# EAGLE design electronic_load (EAGLE 7.3.0)

## Sheet 1 of 2
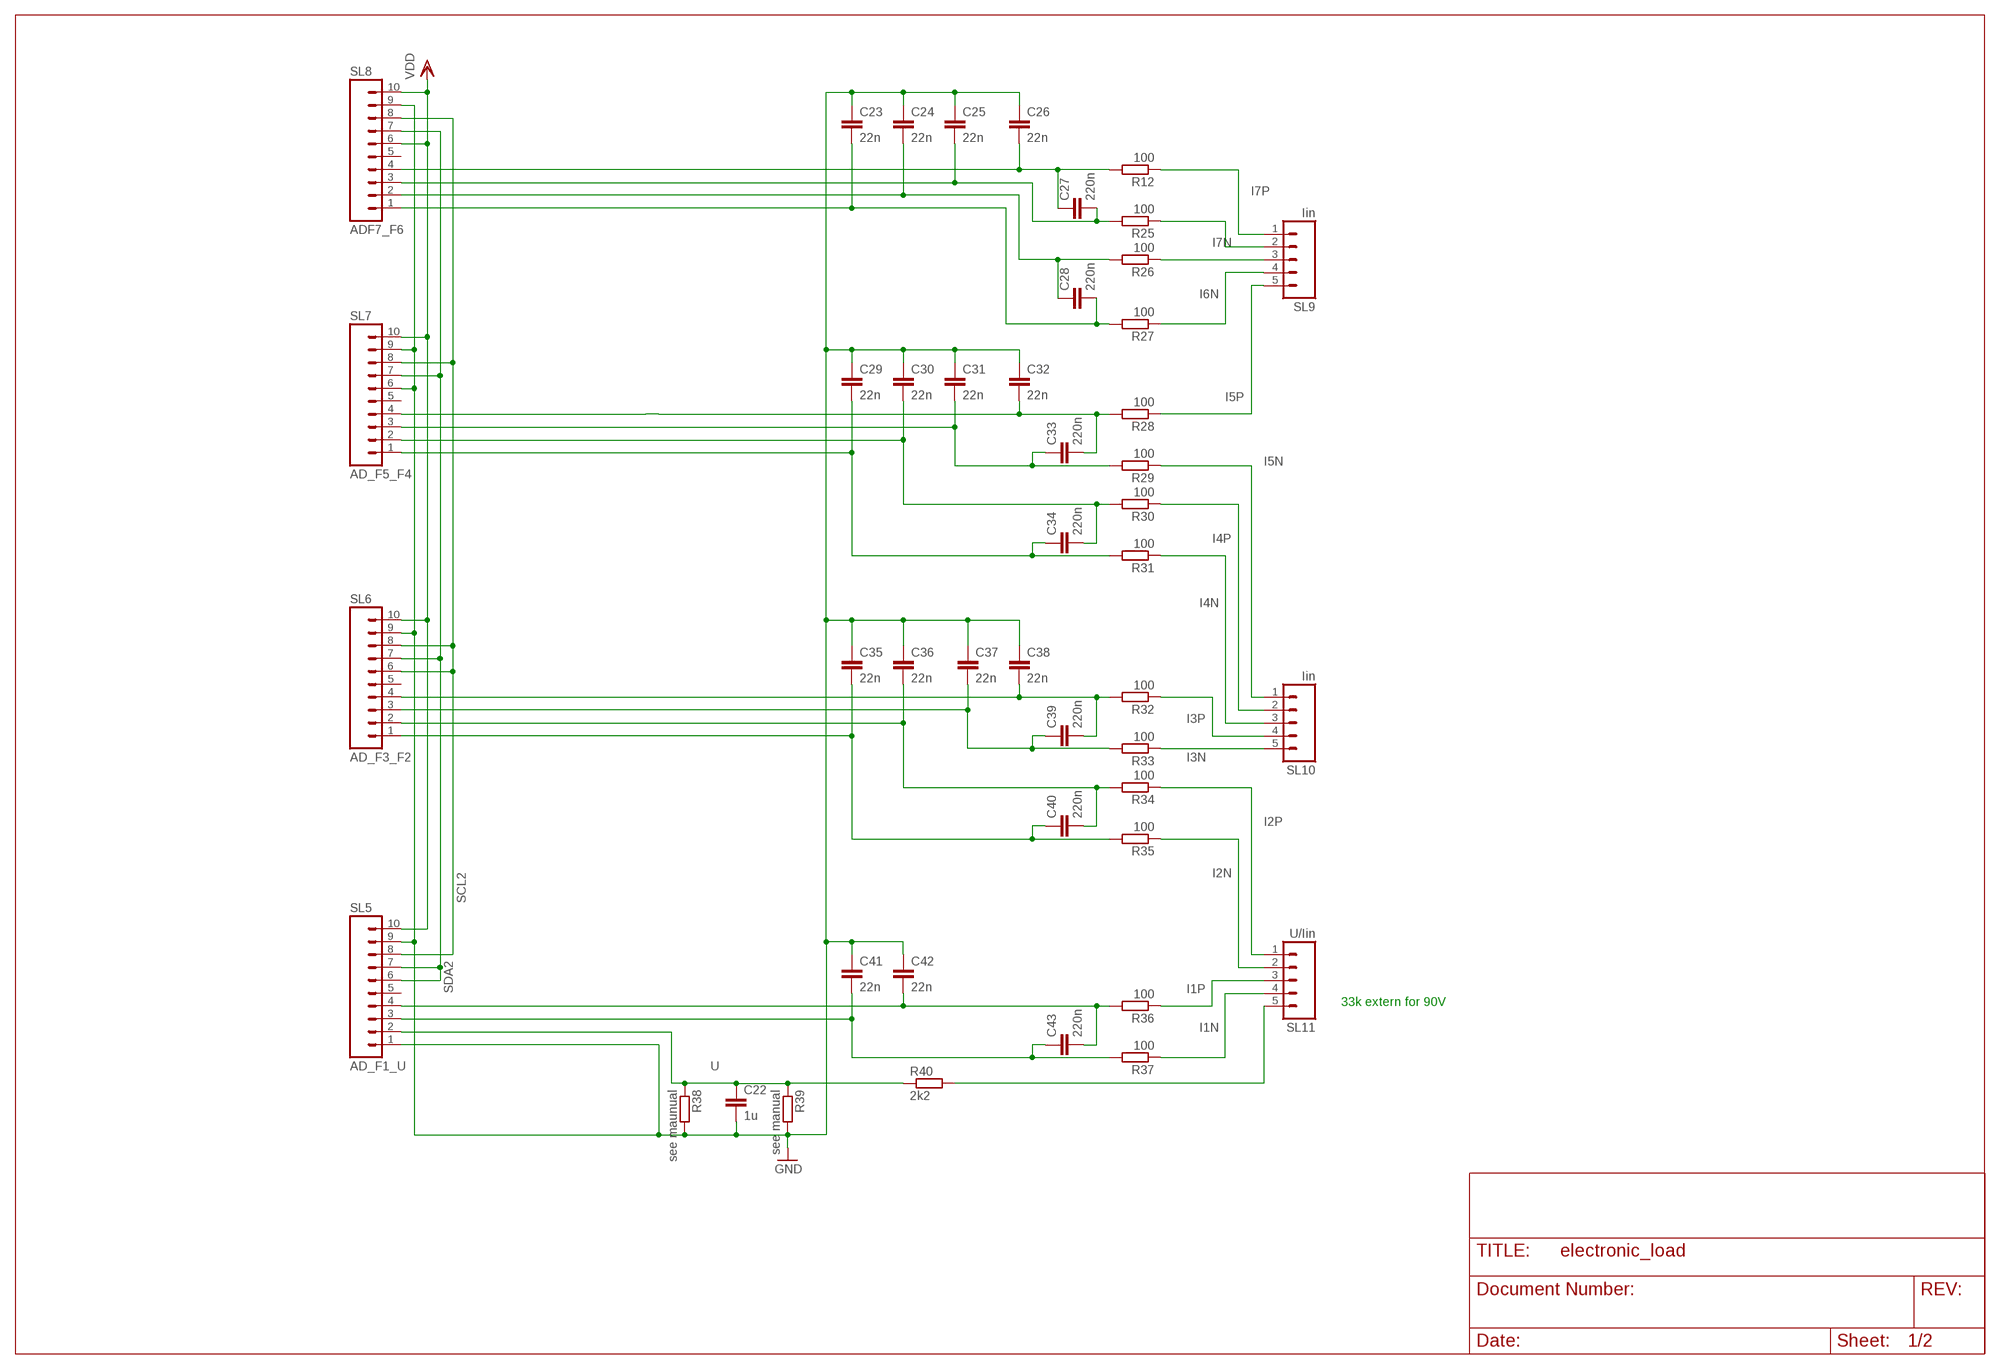
[diagram p0: schematic, sheet 1]

### Parts
C22  1u  C-EUC1206  [C1206]
C23  22n  C-EUC1206  [C1206]
C24  22n  C-EUC1206  [C1206]
C25  22n  C-EUC1206  [C1206]
C26  22n  C-EUC1206  [C1206]
C27  220n  C-EUC1206  [C1206]
C28  220n  C-EUC1206  [C1206]
C29  22n  C-EUC1206  [C1206]
C30  22n  C-EUC1206  [C1206]
C31  22n  C-EUC1206  [C1206]
C32  22n  C-EUC1206  [C1206]
C33  220n  C-EUC1206  [C1206]
C34  220n  C-EUC1206  [C1206]
C35  22n  C-EUC1206  [C1206]
C36  22n  C-EUC1206  [C1206]
C37  22n  C-EUC1206  [C1206]
C38  22n  C-EUC1206  [C1206]
C39  220n  C-EUC1206  [C1206]
C40  220n  C-EUC1206  [C1206]
C41  22n  C-EUC1206  [C1206]
C42  22n  C-EUC1206  [C1206]
C43  220n  C-EUC1206  [C1206]
R12  100  R-EU_R1206  [R1206]
R25  100  R-EU_R1206  [R1206]
R26  100  R-EU_R1206  [R1206]
R27  100  R-EU_R1206  [R1206]
R28  100  R-EU_R1206  [R1206]
R29  100  R-EU_R1206  [R1206]
R30  100  R-EU_R1206  [R1206]
R31  100  R-EU_R1206  [R1206]
R32  100  R-EU_R1206  [R1206]
R33  100  R-EU_R1206  [R1206]
R34  100  R-EU_R1206  [R1206]
R35  100  R-EU_R1206  [R1206]
R36  100  R-EU_R1206  [R1206]
R37  100  R-EU_R1206  [R1206]
R38  see maunual  R-EU_R1206  [R1206]
R39  see manual  R-EU_R1206  [R1206]
R40  2k2  R-EU_R1206  [R1206]
SL5  AD_F1_U  M10  [10P]
SL6  AD_F3_F2  M10  [10P]
SL7  AD_F5_F4  M10  [10P]
SL8  ADF7_F6  M10  [10P]
SL9  Iin  M05  [05P]
SL10  Iin  M05  [05P]
SL11  U/Iin  M05  [05P]

### Nets
GND: C22.2 C23.1 C24.1 C25.1 C26.1 C29.1 C30.1 C31.1 C32.1 C35.1 C36.1 C37.1 C38.1 C41.1 C42.1 R38.2 R39.2 SL5.1 SL5.9 SL6.9 SL7.6 SL7.9 SL8.9 ; also sheet 2
I1N: R37.1 SL11.4
I1P: R36.1 SL11.3
I2N: R35.1 SL11.2
I2P: R34.1 SL11.1
I3N: R33.1 SL10.5
I3P: R32.1 SL10.4
I4N: R31.1 SL10.3
I4P: R30.1 SL10.2
I5N: R29.1 SL10.1
I5P: R28.1 SL9.5
I6N: R27.1 SL9.4
I6P: R26.1 SL9.3
I7N: R25.1 SL9.2
I7P: R12.1 SL9.1
N$1: C26.2 C27.1 R12.2 SL8.4
N$8: C32.2 C33.2 R28.2 SL7.4
N$27: R40.2 SL11.5
N$29: C31.2 C33.1 R29.2 SL7.3
N$30: C30.2 C34.2 R30.2 SL7.2
N$32: C29.2 C34.1 R31.2 SL7.1
N$45: C38.2 C39.2 R32.2 SL6.4
N$48: C37.2 C39.1 R33.2 SL6.3
N$49: C36.2 C40.2 R34.2 SL6.2
N$70: C24.2 C28.1 R26.2 SL8.2
N$71: C25.2 C27.2 R25.2 SL8.3
N$72: C35.2 C40.1 R35.2 SL6.1
N$74: C23.2 C28.2 R27.2 SL8.1
N$76: C42.2 C43.2 R36.2 SL5.4
N$78: C41.2 C43.1 R37.2 SL5.3
SCL2: SL5.8 SL6.6 SL6.8 SL7.8 SL8.8 ; also sheet 2
SDA2: SL5.6 SL5.7 SL6.7 SL7.7 SL8.7 ; also sheet 2
U: C22.1 R38.1 R39.1 R40.1 SL5.2
VDD: SL5.10 SL6.10 SL7.10 SL8.6 SL8.10 ; also sheet 2
Unconnected: SL5.5 SL6.5 SL7.5 SL8.5

### Notes on the sheet
- 33k extern for 90V

## Sheet 2 of 2
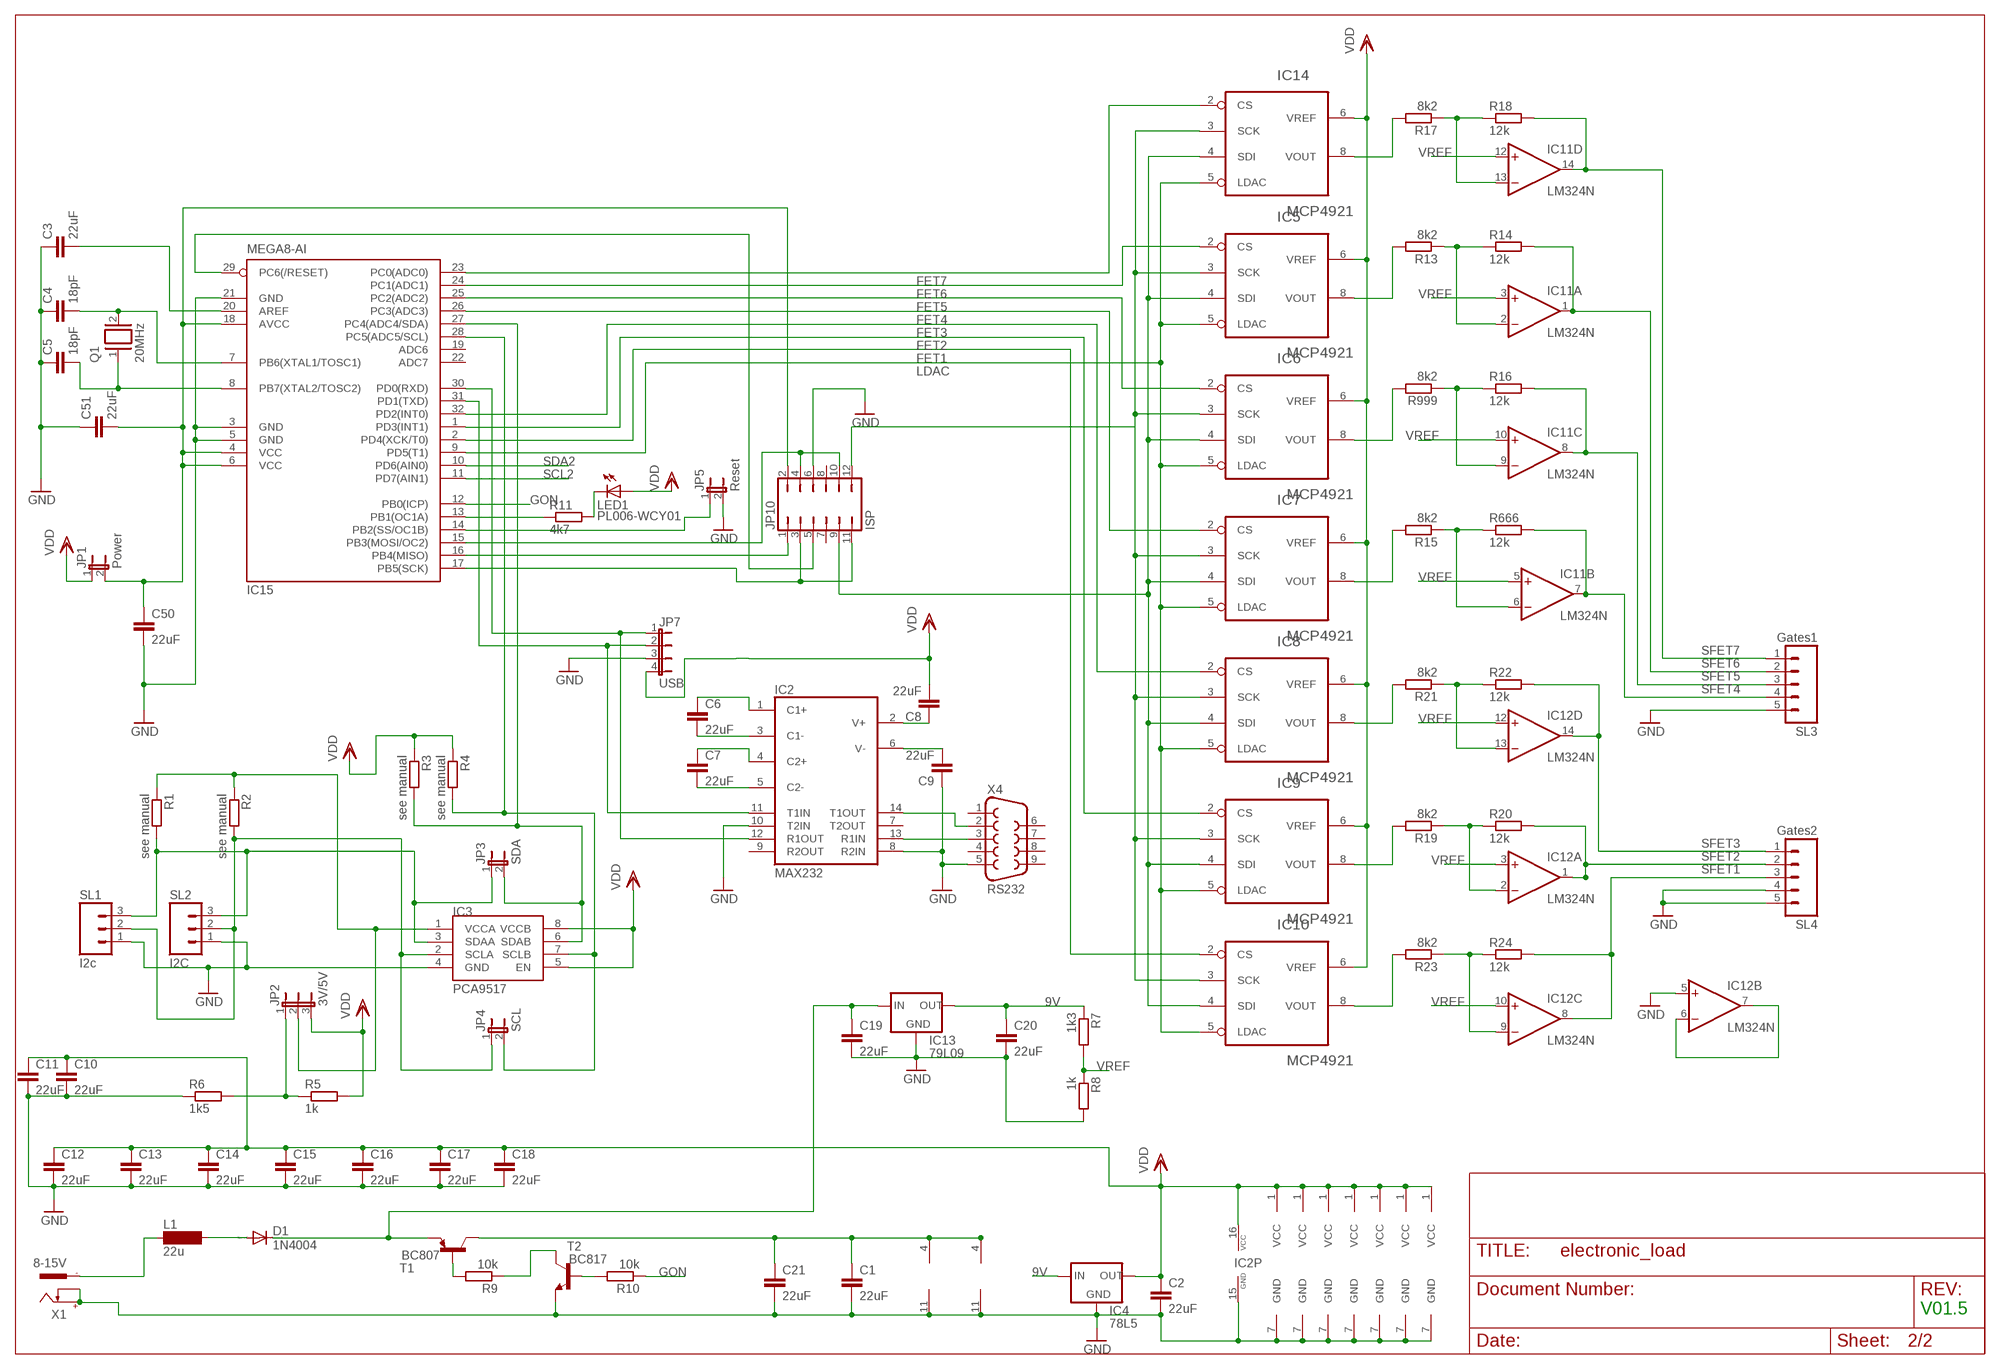
[diagram p1: schematic, sheet 2]

### Parts
C1  22uF  C-EUC1206  [C1206]
C2  22uF  C-EUC1206  [C1206]
C3  22uF  C-EUC1206  [C1206]
C4  18pF  C-EU025-025X050  [C025-025X050]
C5  18pF  C-EU025-025X050  [C025-025X050]
C6  22uF  C-EUC1206  [C1206]
C7  22uF  C-EUC1206  [C1206]
C8  22uF  C-EUC1206  [C1206]
C9  22uF  C-EUC1206  [C1206]
C10  22uF  C-EUC1206  [C1206]
C11  22uF  C-EUC1206  [C1206]
C12  22uF  C-EUC1206  [C1206]
C13  22uF  C-EUC1206  [C1206]
C14  22uF  C-EUC1206  [C1206]
C15  22uF  C-EUC1206  [C1206]
C16  22uF  C-EUC1206  [C1206]
C17  22uF  C-EUC1206  [C1206]
C18  22uF  C-EUC1206  [C1206]
C19  22uF  C-EUC1206  [C1206]
C20  22uF  C-EUC1206  [C1206]
C21  22uF  C-EUC1206  [C1206]
C50  22uF  C-EUC1206  [C1206]
C51  22uF  C-EUC1206  [C1206]
D1  1N4004  [DO41-10]
IC2  MAX232  [DIL16]
IC3  PCA9517  [SO-08]
IC4  78L5  78LXX  [78LXX]
IC5  MCP4921  MCP491  [DIL08]
IC6  MCP4921  MCP491  [DIL08]
IC7  MCP4921  MCP491  [DIL08]
IC8  MCP4921  MCP491  [DIL08]
IC9  MCP4921  MCP491  [DIL08]
IC10  MCP4921  MCP491  [DIL08]
IC11  LM324N  [DIL14]
IC12  LM324N  [DIL14]
IC13  79L09  78LXX  [78LXX]
IC14  MCP4921  MCP491  [DIL08]
IC15  MEGA8-AI  [TQFP32-08]
JP1  Power  JP1E  [JP1]
JP2  3V/5V  JP2E  [JP2]
JP3  SDA  JP1E  [JP1]
JP4  SCL  JP1E  [JP1]
JP5  Reset  JP1E  [JP1]
JP7  USB  JP4E  [JP4]
JP10  ISP  JP6Q  [JP6Q]
L1  22u  MS85  [MS85]
LED1  PL006-WCY01  [SOT23]
Q1  20MHz  XTAL/S  [QS]
R1  see manual  R-EU_R1206  [R1206]
R2  see manual  R-EU_R1206  [R1206]
R3  see manual  R-EU_R1206  [R1206]
R4  see manual  R-EU_R1206  [R1206]
R5  1k  R-EU_R1206  [R1206]
R6  1k5  R-EU_R1206  [R1206]
R7  1k3  R-EU_R1206  [R1206]
R8  1k  R-EU_R1206  [R1206]
R9  10k  R-EU_R1206  [R1206]
R10  10k  R-EU_R1206  [R1206]
R11  4k7  R-EU_R1206  [R1206]
R13  8k2  R-EU_R1206  [R1206]
R14  12k  R-EU_R1206  [R1206]
R15  8k2  R-EU_R1206  [R1206]
R16  12k  R-EU_R1206  [R1206]
R17  8k2  R-EU_R1206  [R1206]
R18  12k  R-EU_R1206  [R1206]
R19  8k2  R-EU_R1206  [R1206]
R20  12k  R-EU_R1206  [R1206]
R21  8k2  R-EU_R1206  [R1206]
R22  12k  R-EU_R1206  [R1206]
R23  8k2  R-EU_R1206  [R1206]
R24  12k  R-EU_R1206  [R1206]
R666  12k  R-EU_R1206  [R1206]
R999  8k2  R-EU_R1206  [R1206]
SL1  I2c  M03  [03P]
SL2  I2C  M03  [03P]
SL3  Gates1  M05  [05P]
SL4  Gates2  M05  [05P]
T1  BC807  BC807-16-PNP-SOT23-BEC  [SOT23-BEC]
T2  BC817  BC817-16-NPN-SOT23-BEC  [SOT23-BEC]
X1  8-15V  737992-55  [737992-5]
X4  RS232  F09H  [F09H]

### Nets
9V: C20.1 IC4.IN IC13.OUT R7.1
C13: C6.1 IC2.1(C1+)
FET1: IC10.2(CS) IC15.2(PD4(XCK/T0))
FET2: IC9.2(CS) IC15.1(PD3(INT1))
FET3: IC8.2(CS) IC15.32(PD2(INT0))
FET4: IC7.2(CS) IC15.26(PC3(ADC3))
FET5: IC6.2(CS) IC15.25(PC2(ADC2))
FET6: IC5.2(CS) IC15.24(PC1(ADC1))
FET7: IC14.2(CS) IC15.23(PC0(ADC0))
GND: C1.2 C2.2 C3.1 C4.1 C5.1 C9.1 C10.2 C11.2 C12.2 C13.2 C14.2 C15.2 C16.2 C17.2 C18.2 C19.2 C20.2 C21.2 C50.2 C51.1 IC2.8(R2IN) IC2.10(T2IN) IC2.15(GND) IC3.4(GND) IC4.GND IC5.7(GND) IC6.7(GND) IC7.7(GND) IC8.7(GND) IC9.7(GND) IC10.7(GND) IC11.11(P:V-) IC12.5(B:+IN) IC12.11(P:V-) IC13.GND IC14.7(GND) IC15.3(GND) IC15.5(GND) IC15.21(GND) JP5.2 JP7.3 JP10.6 R6.1 R8.2 SL1.1 SL2.1 SL3.5 SL4.4 SL4.5 T2.E X1.+ X1.K X4.5 ; also sheet 1
GON: IC15.12(PB0(ICP)) R10.1
LDAC: IC5.5(LDAC) IC6.5(LDAC) IC7.5(LDAC) IC8.5(LDAC) IC9.5(LDAC) IC10.5(LDAC) IC14.5(LDAC) IC15.9(PD5(T1))
N$3: C7.2 IC2.5(C2-)
N$4: C50.1 C51.2 IC15.4(VCC) IC15.6(VCC) IC15.18(AVCC) JP1.2 JP10.2
N$5: IC3.3(SDAA) JP3.1 R1.2 SL1.3 SL2.3
N$6: IC2.11(T1IN) IC15.31(PD1(TXD)) JP7.2
N$7: L1.1 X1.-1
N$9: IC2.13(R1IN) X4.3
N$10: IC6.8(VOUT) R999.2
N$11: C5.2 IC15.8(PB7(XTAL2/TOSC2)) Q1.1
N$12: D1.A L1.2
N$13: C7.1 IC2.4(C2+)
N$14: C6.2 IC2.3(C1-)
N$15: IC15.16(PB4(MISO)) JP10.1
N$16: C8.1 IC2.2(V+)
N$17: C9.2 IC2.6(V-)
N$18: IC15.29(PC6(/RESET)) JP10.5
N$19: C4.2 IC15.7(PB6(XTAL1/TOSC1)) Q1.2
N$20: IC5.4(SDI) IC6.4(SDI) IC7.4(SDI) IC8.4(SDI) IC9.4(SDI) IC10.4(SDI) IC14.4(SDI) JP10.9
N$21: IC14.8(VOUT) R17.2
N$22: IC3.2(SCLA) JP4.1 R2.2 SL1.2 SL2.2
N$23: IC15.15(PB3(MOSI/OC2)) JP10.4 JP10.10
N$24: IC9.8(VOUT) R19.2
N$26: IC8.8(VOUT) R21.2
N$28: IC5.3(SCK) IC6.3(SCK) IC7.3(SCK) IC8.3(SCK) IC9.3(SCK) IC10.3(SCK) IC14.3(SCK) JP10.12
N$31: IC5.8(VOUT) R13.2
N$33: IC2.14(T1OUT) X4.2
N$35: IC3.6(SDAB) IC15.27(PC4(ADC4/SDA)) JP3.2 R3.2
N$36: IC11.13(D:-IN) R17.1 R18.1
N$37: IC15.14(PB2(SS/OC1B)) JP5.1
N$38: IC11.9(C:-IN) R16.1 R999.1
N$39: IC10.8(VOUT) R23.2
N$40: IC12.13(D:-IN) R21.1 R22.1
N$42: IC2.12(R1OUT) IC15.30(PD0(RXD)) JP7.1
N$43: LED1.3(C) R11.2
N$46: IC15.17(PB5(SCK)) JP10.3 JP10.11
N$50: IC3.7(SCLB) IC15.28(PC5(ADC5/SCL)) JP4.2 R4.2
N$51: JP2.1 R5.1 R6.2
N$54: IC15.13(PB1(OC1A)) R11.1
N$55: IC7.8(VOUT) R15.2
N$56: C19.1 D1.C IC13.IN T1.E
N$57: IC12.2(A:-IN) R19.1 R20.1
N$58: IC12.9(C:-IN) R23.1 R24.1
N$59: C1.1 C21.1 IC11.4(P:V+) IC12.4(P:V+) T1.C
N$60: C3.2 IC15.20(AREF)
N$61: R9.2 T1.B
N$62: IC3.1(VCCA) JP2.2 R1.1 R2.1
N$63: R9.1 T2.C
N$64: R10.2 T2.B
N$73: IC11.6(B:-IN) R15.1 R666.1
N$91: IC11.2(A:-IN) R13.1 R14.1
N$96: IC12.6(B:-IN) IC12.7(B:OUT)
SCL2: IC15.11(PD7(AIN1)) ; also sheet 1
SDA2: IC15.10(PD6(AIN0)) ; also sheet 1
SFET1: IC12.8(C:OUT) R24.2 SL4.3
SFET2: IC12.1(A:OUT) R20.2 SL4.2
SFET3: IC12.14(D:OUT) R22.2 SL4.1
SFET4: IC11.7(B:OUT) R666.2 SL3.4
SFET5: IC11.8(C:OUT) R16.2 SL3.3
SFET6: IC11.1(A:OUT) R14.2 SL3.2
SFET7: IC11.14(D:OUT) R18.2 SL3.1
VDD: C2.1 C8.2 C10.1 C11.1 C12.1 C13.1 C14.1 C15.1 C16.1 C17.1 C18.1 IC2.16(VCC) IC3.5(EN) IC3.8(VCCB) IC4.OUT IC5.1(VCC) IC5.6(VREF) IC6.1(VCC) IC6.6(VREF) IC7.1(VCC) IC7.6(VREF) IC8.1(VCC) IC8.6(VREF) IC9.1(VCC) IC9.6(VREF) IC10.1(VCC) IC10.6(VREF) IC14.1(VCC) IC14.6(VREF) JP1.1 JP2.3 JP7.4 LED1.1(A) R3.1 R4.1 R5.2 ; also sheet 1
VREF: IC11.3(A:+IN) IC11.5(B:+IN) IC11.10(C:+IN) IC11.12(D:+IN) IC12.3(A:+IN) IC12.10(C:+IN) IC12.12(D:+IN) R7.2 R8.1
Unconnected: IC2.7(T2OUT) IC2.9(R2OUT) IC15.19(ADC6) IC15.22(ADC7) JP10.7 JP10.8 X1.-2 X4.1 X4.4 X4.6 X4.7 X4.8 X4.9

### Notes on the sheet
- V01.5

## Library data of the parts
C1-C3 C6-C21 C50 C51 = rcl:C-EU: CAPACITOR, European symbol
C4 C5 C22-C43 = resistor:C-EU: CAPACITOR, European symbol
D1 = diode:1N4004: DIODE general purpose rectifier, 1 A
IC2 = maxim:MAX232: RS232 TRANSCEIVER; MF: MAXIM; MPN: MAX232ACPE+; OC_FARNELL: 9723773; OC_NEWARK: 68K4544
IC3 = PCA9517:PCA9517: PCA9517
IC4 IC13 = v-reg:78LXX: VOLTAGE REGULATOR
IC5-IC10 IC14 = dac:MCP49*1: Digital-to-Analog Converter
IC11 IC12 = linear:LM324: OP AMP
IC15 = atmel:MEGA8: MICROCONTROLLER 8 Kbytes FLASH, 1 kbytes SRAM, 512 bytes EEPROM, USART, 6-channel 10 bit ADC, 2-channel 8 bit ADC Pin compatible with Atmega48, ATMega88, ATMega168 Source: avr.lbr; MPN: ATMEGA8-16AU; OC_FARNELL: 9171371; OC_NEWARK: 73M8863
JP1 JP3-JP5 = jumper:JP1E: JUMPER
JP2 = jumper:JP2E: JUMPER
JP7 = jumper:JP4E: JUMPER
JP10 = jumper:JP6Q: JUMPER
L1 = inductor-neosid:MS85: INDUCTOR SMD power inductor; OC_FARNELL: unknown; OC_NEWARK: unknown
LED1 = led:PL006*: PLH006 Series SMD LED SOT23 PLH006-WCR21 Super Red PLH006-WCR12 High Eff Red PLH006-WCG13 Green PLH006-WCY01 Yellow www.p-tec.net Source: http://www.wittig-electronic.de/PTEC/PL006Series.pdf
Q1 = special:XTAL/S: CRYSTAL
R1-R40 R666 R999 = resistor:R-EU_: RESISTOR, European symbol
SL1 SL2 = con-amp-quick:M03: AMP QUICK CONNECTOR; OC_FARNELL: unknown; OC_NEWARK: unknown
SL3 SL4 SL9-SL11 = con-amp-quick:M05: AMP QUICK CONNECTOR; OC_FARNELL: unknown; OC_NEWARK: unknown
SL5-SL8 = con-amp-quick:M10: AMP QUICK CONNECTOR; OC_FARNELL: unknown; OC_NEWARK: unknown
T1 = transistor:*-PNP-: PNP Transistror
T2 = transistor:*-NPN-: NPN Transistror BF959 corrected 2008.03.06
X1 = con-conrad:737992-55: FEMALE PRINT CONNECTOR DIN 45323 (34V/3A), ROKA, distributor Conrad
X4 = con-subd:F09: SUB-D; OC_FARNELL: unknown; OC_NEWARK: unknown

## Board
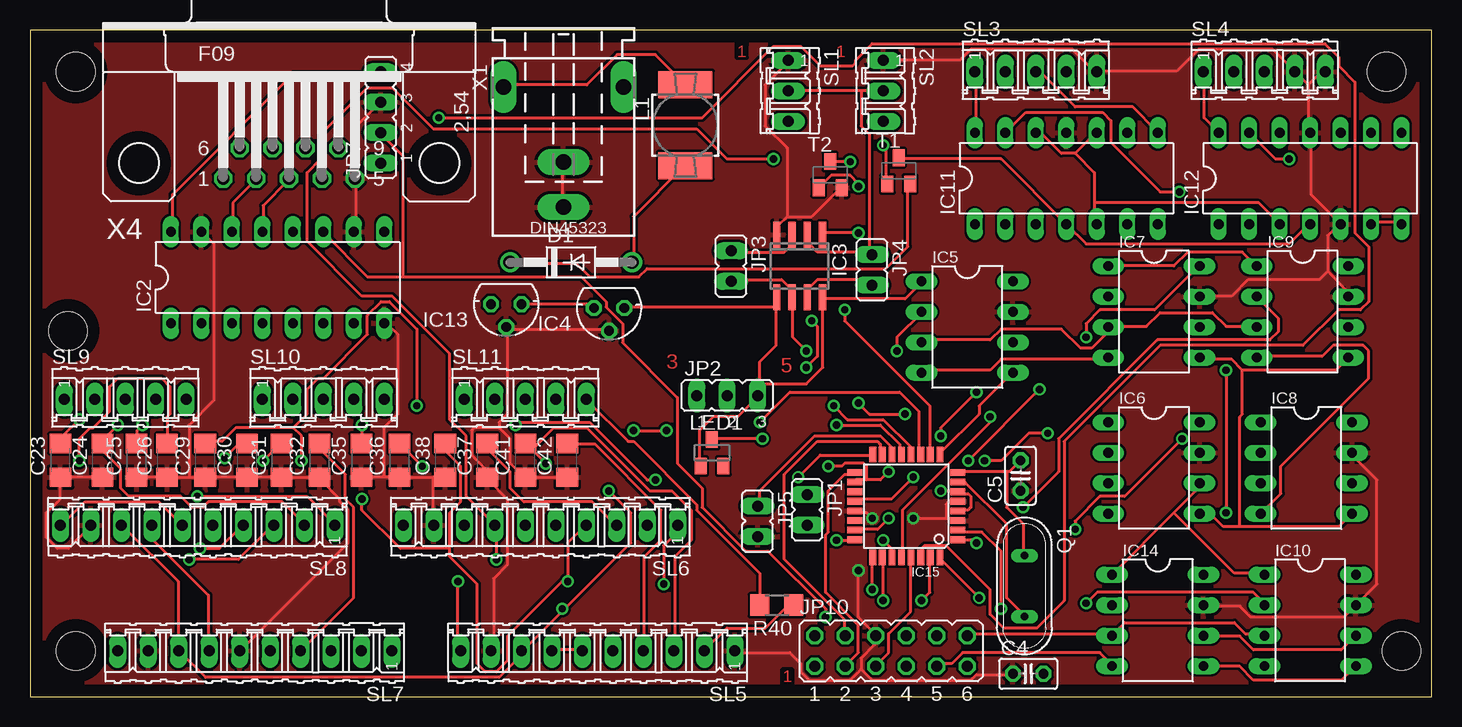
[diagram p2: board, top side]
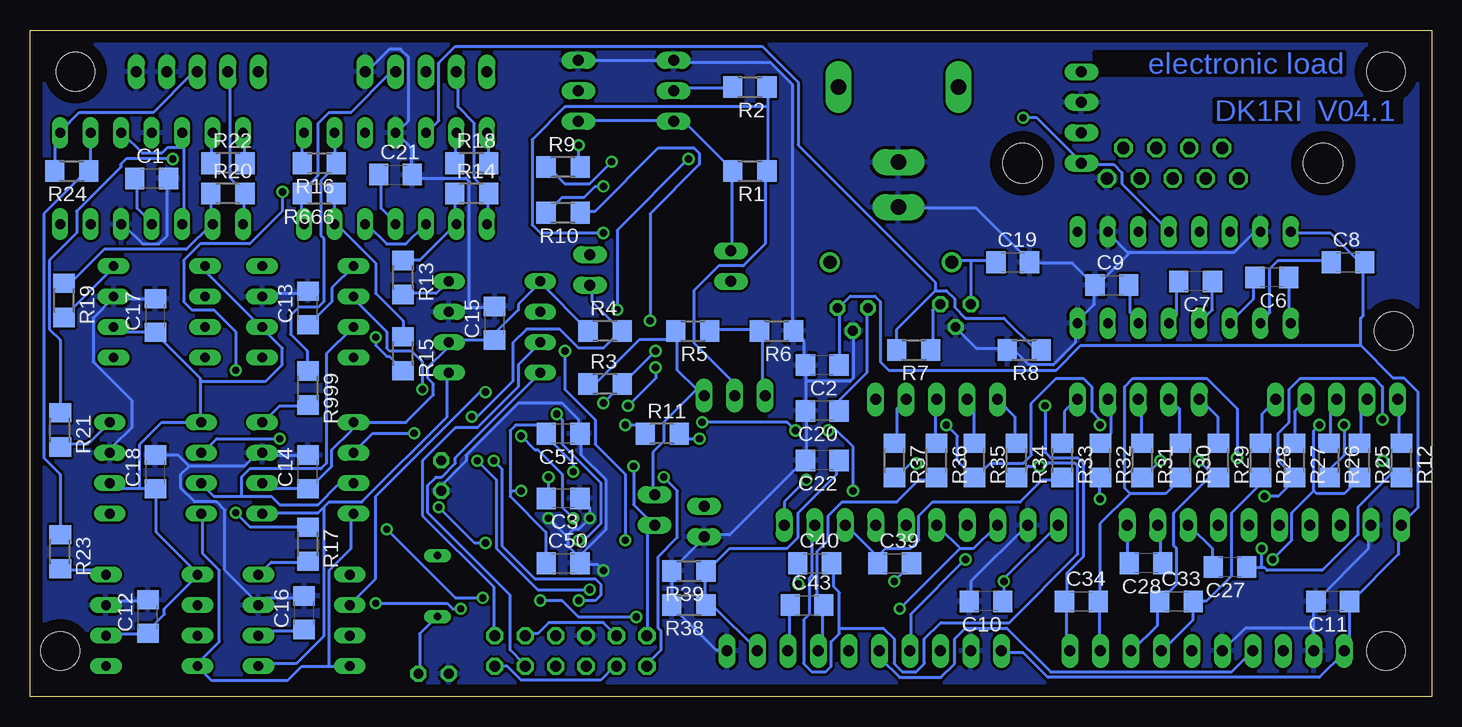
[diagram p3: board, bottom side, seen from below]

Size 116.82 x 55.55 mm. Coordinates in mm from the lower left corner, seen from the top.
Outline: 0,0 116.82,0 116.82,55.55 0,55.55 0,0
Copper layers (1*16): Top 0.035mm / dielectric 1.5mm / Bottom 0.035mm
Design rules "default": minimum track width 10mil, minimum drill 24mil, track to track 8mil, track to pad 8mil, pad to pad 8mil, via to via 8mil, smd to smd 8mil, copper to edge 40mil, drill to drill 8mil, minimum pad ring 10mil, minimum via ring 8mil, stop-mask expansion 4mil, vias tented up to drill 0mil, thermal gap 10mil
Holes 3.2 mm at 3.81,52.07 3.81,3.81 114.3,3.81 113.03,52.07 3.17,30.48

### Footprints (pad centres in the part's own frame; a part is rotated, then mirrored left to right if it is on the bottom)
C1206 = smd 1.6 x 1.8: 1 -1.4,0; 2 1.4,0
C025-025X050 = drill 0.813 octagon: 1 -1.27,0; 2 1.27,0
DO41-10 = drill 1.118: A 5.08,0; C -5.08,0
DIL16 = drill 0.813 long: 1 -8.89,-3.81; 2 -6.35,-3.81; 3 -3.81,-3.81; 4 -1.27,-3.81; 5 1.27,-3.81; 6 3.81,-3.81; 7 6.35,-3.81; 8 8.89,-3.81; 9 8.89,3.81; 10 6.35,3.81; 11 3.81,3.81; 12 1.27,3.81; 13 -1.27,3.81; 14 -3.81,3.81; 15 -6.35,3.81; 16 -8.89,3.81
SO-08 = smd 0.6 x 2.2: 1 -1.905,-2.6; 2 -0.635,-2.6; 3 0.635,-2.6; 4 1.905,-2.6; 5 1.905,2.6; 6 0.635,2.6; 7 -0.635,2.6; 8 -1.905,2.6
78LXX = drill 0.813 octagon: GND 0,1.905; IN 1.27,0; OUT -1.27,0
DIL08 = drill 0.813 long: 1 -3.81,-3.81; 2 -1.27,-3.81; 3 1.27,-3.81; 4 3.81,-3.81; 5 3.81,3.81; 6 1.27,3.81; 7 -1.27,3.81; 8 -3.81,3.81
DIL14 = drill 0.813 long: 1 -7.62,-3.81; 2 -5.08,-3.81; 3 -2.54,-3.81; 4 0,-3.81; 5 2.54,-3.81; 6 5.08,-3.81; 7 7.62,-3.81; 8 7.62,3.81; 9 5.08,3.81; 10 2.54,3.81; 11 0,3.81; 12 -2.54,3.81; 13 -5.08,3.81; 14 -7.62,3.81
TQFP32-08 = smd 1.27 x 0.559: 1 -4.293,2.8; 2 -4.293,2; 3 -4.293,1.2; 4 -4.293,0.4; 5 -4.293,-0.4; 6 -4.293,-1.2; 7 -4.293,-2; 8 -4.293,-2.8; 17 4.293,-2.8; 18 4.293,-2; 19 4.293,-1.2; 20 4.293,-0.4; 21 4.293,0.4; 22 4.293,1.2; 23 4.293,2; 24 4.293,2.8 | smd 0.559 x 1.27: 9 -2.8,-4.293; 10 -2,-4.293; 11 -1.2,-4.293; 12 -0.4,-4.293; 13 0.4,-4.293; 14 1.2,-4.293; 15 2,-4.293; 16 2.8,-4.293; 25 2.8,4.293; 26 2,4.293; 27 1.2,4.293; 28 0.4,4.293; 29 -0.4,4.293; 30 -1.2,4.293; 31 -2,4.293; 32 -2.8,4.293
JP1 = drill 0.914 long: 1 0,-1.27; 2 0,1.27
JP2 = drill 0.914 long: 1 -2.54,0; 2 0,0; 3 2.54,0
JP4 = drill 0.914 long: 1 -3.81,0; 2 -1.27,0; 3 1.27,0; 4 3.81,0
JP6Q = drill 0.914 octagon: 1 -6.35,-1.27; 2 -6.35,1.27; 3 -3.81,-1.27; 4 -3.81,1.27; 5 -1.27,-1.27; 6 -1.27,1.27; 7 1.27,-1.27; 8 1.27,1.27; 9 3.81,-1.27; 10 3.81,1.27; 11 6.35,-1.27; 12 6.35,1.27
MS85 = smd 4.5 x 2.25: 1 0,-3.383; 2 0,3.383
SOT23 = smd 1 x 1.4: 1 -0.95,-1.1; 2 0.95,-1.1; 3 0,1.1
QS = drill 0.61 long: 1 -2.54,0; 2 2.54,0
R1206 = smd 1.6 x 1.803: 1 -1.422,0; 2 1.422,0
03P = drill 0.914 long: 1 -2.54,0; 2 0,0; 3 2.54,0
05P = drill 0.914 long: 1 -5.08,0; 2 -2.54,0; 3 0,0; 4 2.54,0; 5 5.08,0
10P = drill 0.914 long: 1 -11.43,0; 2 -8.89,0; 3 -6.35,0; 4 -3.81,0; 5 -1.27,0; 6 1.27,0; 7 3.81,0; 8 6.35,0; 9 8.89,0; 10 11.43,0
SOT23-BEC = smd 1 x 1.4: B -0.95,-1.1; C 0,1.1; E 0.95,-1.1
737992-5 = drill 1.3 pad 2.184 long: + 0,10; -1 5,0; -2 -5,0; K 0,6.25
F09H = drill 1.016 octagon: 1 -5.486,-1.27; 2 -2.743,-1.27; 3 0,-1.27; 4 2.743,-1.27; 5 5.486,-1.27; 6 -4.115,1.27; 7 -1.372,1.27; 8 1.372,1.27; 9 4.115,1.27 | hole 3.302: -12.522,0; 12.522,0

### Placement (x,y rotation side)
C1  106.68,43.18 0 bottom
C2  50.8,27.62 180 bottom
C3  72.39,16.51 180 bottom
C4  83.19,1.91 0 top
C5  82.55,18.41 90 top
C6  13.34,34.92 180 bottom
C7  19.68,34.61 180 bottom
C8  6.99,36.2 0 bottom
C9  26.67,34.29 0 bottom
C10  37.15,7.94 180 bottom
C11  8.26,7.94 180 bottom
C12  107,6.67 90 bottom
C13  93.66,32.38 90 bottom
C14  93.66,18.73 90 bottom
C15  78.11,31.11 90 bottom
C16  93.98,6.99 90 bottom
C17  106.36,31.75 90 bottom
C18  106.36,18.73 90 bottom
C19  34.92,36.2 0 bottom
C20  50.8,23.81 180 bottom
C21  86.36,43.5 0 bottom
C22  50.8,19.68 180 bottom
C23  2.54,19.68 90 top
C24  6.03,19.68 90 top
C25  8.89,19.68 90 top
C26  11.43,19.68 90 top
C27  16.83,10.79 180 bottom
C28  23.81,11.11 180 bottom
C29  14.61,19.68 90 top
C30  18.1,19.68 90 top
C31  20.95,19.68 90 top
C32  24.13,19.68 90 top
C33  21.27,7.94 0 bottom
C34  29.21,7.94 0 bottom
C35  27.62,19.68 90 top
C36  30.8,19.68 90 top
C37  38.1,19.68 90 top
C38  34.61,19.68 90 top
C39  44.77,11.11 0 bottom
C40  51.44,11.11 0 bottom
C41  41.27,19.68 90 top
C42  44.77,19.68 90 top
C43  52.07,7.62 0 bottom
C50  72.39,11.11 0 bottom
C51  72.39,21.91 180 bottom
D1  45.09,36.2 0 top
IC2  20.64,34.92 0 top
IC3  64.14,35.88 180 top
IC4  48.26,32.38 180 top
IC5  78.11,30.8 270 top
IC6  93.66,19.05 270 top
IC7  93.66,32.07 270 top
IC8  106.36,19.05 270 top
IC9  106.05,32.07 270 top
IC10  106.68,6.35 270 top
IC11  86.36,43.18 0 top
IC12  106.68,43.18 0 top
IC13  39.69,32.7 180 top
IC14  93.98,6.35 270 top
IC15  73.03,15.88 180 top
JP1  64.77,15.56 180 top
JP2  58.1,25.08 0 top
JP3  58.42,35.88 180 top
JP4  70.17,35.56 180 top
JP5  60.64,14.61 180 top
JP7  29.21,48.26 90 top
JP10  71.75,3.81 0 top
L1  54.61,47.62 180 top
LED1  56.83,20.32 0 top
Q1  82.87,9.21 270 top
R1  56.83,43.81 180 bottom
R2  56.83,50.8 180 bottom
R3  68.9,26.04 0 bottom
R4  68.9,30.48 0 bottom
R5  61.59,30.48 180 bottom
R6  54.61,30.48 180 bottom
R7  43.18,28.89 180 bottom
R8  33.97,28.89 180 bottom
R9  72.39,44.13 0 bottom
R10  72.39,40.32 180 bottom
R11  64.14,21.91 0 bottom
R12  2.54,19.68 270 bottom
R13  85.72,34.92 270 bottom
R14  80.01,41.91 0 bottom
R15  85.72,28.57 270 bottom
R16  92.71,44.45 180 bottom
R17  93.66,12.7 270 bottom
R18  80.01,44.45 0 bottom
R19  113.98,33.02 270 bottom
R20  100.33,41.91 0 bottom
R21  114.3,22.23 270 bottom
R22  100.33,44.45 0 bottom
R23  114.3,12.06 270 bottom
R24  113.35,43.81 180 bottom
R25  6.03,19.68 270 bottom
R26  8.57,19.68 270 bottom
R27  11.43,19.68 270 bottom
R28  14.29,19.68 270 bottom
R29  17.78,19.68 270 bottom
R30  20.95,19.68 270 bottom
R31  24.13,19.68 270 bottom
R32  27.62,19.68 270 bottom
R33  30.8,19.68 270 bottom
R34  34.61,19.68 270 bottom
R35  38.1,19.68 270 bottom
R36  41.27,19.68 270 bottom
R37  44.77,19.68 270 bottom
R38  61.91,7.62 180 bottom
R39  61.91,10.48 180 bottom
R40  62.23,7.62 180 top
R666  92.71,41.91 180 bottom
R999  93.66,25.72 270 bottom
SL1  63.18,50.48 270 top
SL2  71.12,50.48 270 top
SL3  83.82,52.07 0 top
SL4  102.87,52.07 0 top
SL5  47.31,3.81 180 top
SL6  42.55,14.29 180 top
SL7  18.73,3.81 180 top
SL8  13.97,14.29 180 top
SL9  7.94,24.77 0 top
SL10  24.45,24.77 0 top
SL11  41.27,24.77 0 top
T1  72.39,43.81 0 top
T2  66.67,43.5 0 top
X1  44.45,50.8 180 top
X4  21.59,44.45 0 top

### Tracks (layer width: path | path; a pad name or v marks a point on that pad's centre or on a via)
9V
  Top 0.254: IC13.OUT 41.15,32.69 46.63,32.69 46.86,32.46 IC4.IN
  Bottom 0.254: R7.1 41.6,29.03 41.6,32.23 41.15,32.69 IC13.OUT | C20.1 49.38,24 49.38,24.69 47.09,26.98 47.09,32.23 IC4.IN
C13
  Bottom 0.254: C6.1 11.89,34.75 11.89,31.32 IC2.1
FET1  (via drill 0.61)
  Top 0.254: v80.92,7.32 80.92,12.12 79.32,13.72 77.5,13.72 IC15.2 | v88.01,7.77 88.92,8.69 101.96,8.69 102.87,7.77 IC10.2
  Bottom 0.254: v80.92,7.32 81.61,7.32 82.07,7.77 v88.01,7.77
FET2  (via drill 0.61)
  Top 0.254: v78.87,12.8 78.64,13.03 77.5,13.03 IC15.1 | v82.75,15.77 85.72,18.75 85.72,21.49 93.95,29.72 103.33,29.72 104.01,30.4 104.01,31.55 102.41,33.15 IC9.2
  Bottom 0.254: v78.87,12.8 79.78,12.8 v82.75,15.77
FET3  (via drill 0.61)
  Top 0.254: v79.1,8.23 75.89,11.43 IC15.32 | v87.1,13.95 87.1,14.63 89.15,16.69 91.21,16.69 v96.01,21.49
  Bottom 0.254: v79.1,8.23 81.38,8.23 v87.1,13.95 | v96.01,21.49 101.27,21.49 102.41,20.34 IC8.2
FET4  (via drill 0.61)
  Top 0.254: v71.09,8 71.09,11.43 IC15.26 | v84.12,25.6 v78.18,19.66
  Bottom 0.254: v71.09,8 69.72,8 69.27,8.46 69.27,9.37 69.72,9.83 74.75,9.83 77.5,12.57 77.5,18.97 v78.18,19.66 | v84.12,25.6 84.12,27.89 85.04,28.8 86.87,28.8 87.1,29.03 87.1,30.4 89.84,33.15 IC7.2
FET5  (via drill 0.61)
  Top 0.254: v70.18,8.91 70.18,11.43 IC15.25 | v79.55,19.66 80.92,19.66 83.21,21.95 v84.81,21.95
  Bottom 0.254: v70.18,8.91 74.52,8.91 77.95,12.34 77.95,18.06 v79.55,19.66 | v84.81,21.95 88.24,21.95 89.84,20.34 IC6.2
FET6  (via drill 0.61)
  Top 0.254: v67.21,13.03 68.58,13.03 IC15.24 | v72.24,28.8 72.24,29.95 74.3,32 IC5.2
  Bottom 0.254: v67.21,13.03 67.21,18.52 69.72,21.03 69.72,23.09 72.24,25.6 v72.24,28.8
FET7  (via drill 0.61)
  Top 0.254: v71.55,14.86 70.64,13.95 68.81,13.95 IC15.23 | v75.89,21.72 75.89,22.4 v78.87,25.38
  Bottom 0.254: v71.55,14.86 72.47,15.77 72.47,18.52 74.52,20.57 74.75,20.57 v75.89,21.72 | v78.87,25.38 79.32,25.38 88.01,16.69 88.01,9.83 90.07,7.77 IC14.2
GND  (via drill 0.61)
  Top 0.254: 63.09,40.01 65.15,40.01 67.44,42.29 T2.E | 63.09,40.01 62.41,39.32 62.41,38.63 IC3.4 | 63.09,40.01 63.09,45.72 61.27,47.55 61.27,50.98 63.09,52.81 SL1.1 | SL2.1 71.32,53.03 77.5,53.03 78.41,53.95 86.87,53.95 88.7,52.12 SL3.5 88.92,52.12 95.56,52.12 97.38,53.95 103.56,53.95 105.39,52.12 SL4.4 105.61,51.89 106.53,50.98 | IC8.7 110.19,20.12 112.24,18.06 112.24,9.37 IC10.7 109.5,6.63 101.73,6.63 100.81,7.54 97.84,7.54 IC14.7 | 106.53,50.98 106.53,47.09 IC12.11 106.76,46.86 106.76,41.83 IC12.5 109.04,39.32 108.13,38.41 108.13,35.43 | 106.53,50.98 107.44,51.89 107.9,51.89 SL4.5 | 108.13,35.43 109.73,33.83 109.73,33.38 IC9.7 | 108.13,35.43 107.44,34.75 101.5,34.75 100.13,33.38 97.61,33.38 IC7.7 | 76.35,14.86 77.27,14.86 IC15.3 | 76.35,14.86 76.35,16 76.58,16.23 77.27,16.23 IC15.5 | v70.18,14.86 69.72,15.32 68.81,15.32 IC15.21 | v73.61,14.86 76.35,14.86 | 39.09,22.4 37.03,22.4 36.8,22.17 36.8,20.12 37.95,18.97 37.95,18.29 C37.1 38.18,18.06 39.78,16.46 39.78,10.97 38.63,9.83 38.63,3.89 SL5.9 | 39.09,22.4 40.01,21.49 40.01,19.43 41.15,18.29 C41.1 41.38,18.29 44.58,18.29 C42.1 | 69.27,2.29 70.18,1.37 78.41,1.37 78.87,1.83 81.84,1.83 C4.1 | 69.27,2.29 69.27,3.2 70.41,4.34 70.41,5.03 JP10.6 70.41,5.26 69.04,6.63 v69.04,10.52 | 39.78,30.63 48.23,30.63 IC4.GND | 69.27,2.29 68.35,1.37 64.92,1.37 64.24,2.06 64.24,2.74 63.32,3.66 58.75,3.66 SL5.1 | 39.09,22.4 39.09,22.86 39.78,23.55 39.78,30.63 | 39.78,30.63 IC13.GND | C26.1 8.91,18.29 C25.1 | C26.1 13.26,18.29 | 13.26,18.29 14.4,18.29 C29.1 14.63,18.29 18.06,18.29 C30.1 18.29,18.29 20.8,18.29 C31.1 21.03,18.29 24,18.29 C32.1 24.23,18.06 25.83,16.46 25.83,16.23 26.52,15.54 26.52,12.8 17.6,3.89 SL7.6
  Top 0.254: C26.1 | C24.1 5.94,18.29 2.74,18.29 C23.1 2.52,18.06 2.52,16.46 1.37,15.32 1.37,13.26 2.29,12.34 3.2,12.34 5.03,14.17 SL8.9 | 29.49,18.29 30.63,18.29 C36.1 30.86,18.29 33.6,18.29 | 29.49,18.29 27.66,18.29 C35.1 | 33.6,18.29 34.52,18.29 C38.1 | 33.6,18.29 33.6,14.4 SL6.9 | JP7.3 29.03,49.38 27.2,47.55 27.2,43.2 X4.5 27.2,42.98 27.2,38.86 IC2.10 | X1.+ 44.35,40.92 44.35,44.35 X1.K | 29.49,18.29 29.49,22.4 30.63,23.55 30.63,30.18 29.72,31.09 IC2.8 | 13.26,18.29 13.26,22.63 15.32,24.69 15.32,37.72 14.4,38.63 IC2.15
  Bottom 0.254: SL2.1 71.09,53.03 63.32,53.03 SL1.1 63.09,52.81 55.09,52.81 53.26,50.98 53.26,30.63 R6.1 53.03,30.4 52.35,29.72 52.35,27.66 C2.2 52.12,27.43 52.12,26.29 | 80.24,32.46 81.61,32.46 81.84,32.23 IC5.7 | 80.24,32.46 78.18,32.46 C15.2 | SL3.5 88.7,52.12 86.87,53.95 85.95,53.95 85.27,53.26 85.27,48.01 86.18,47.09 IC11.11 86.18,46.86 85.04,45.72 85.04,43.66 C21.2 84.81,43.43 84.58,43.2 80.47,43.2 80.24,42.98 80.24,32.46 | C14.2 93.73,20.12 97.38,20.12 IC6.7 97.61,20.12 98.07,20.12 98.98,19.2 103.56,19.2 | 103.56,19.2 104.47,20.12 106.3,20.12 C18.2 | C16.2 94.18,8.23 97.16,8.23 97.61,7.77 IC14.7 97.84,7.77 100.58,10.52 100.58,15.54 101.27,16.23 103.1,16.23 104.24,17.37 104.24,18.52 103.56,19.2 | C12.2 107.21,8 110.19,8 110.41,7.77 IC10.7 | C13.2 93.73,33.6 97.16,33.6 97.38,33.38 IC7.7 | C17.2 106.53,33.15 109.73,33.15 IC9.7 109.96,33.15 111.56,31.55 111.56,27.89 108.36,24.69 108.36,22.4 109.96,20.8 109.96,20.34 IC8.7 | C1.2 105.39,42.98 105.39,38.41 106.07,37.72 107.44,37.72 109.04,39.32 IC12.5 | C3.1 70.87,16.46 70.18,15.77 v70.18,14.86 71.09,13.95 71.55,13.95 72.01,13.49 72.01,13.26 | 71.09,11.66 71.09,11.2 C50.2 | 71.09,11.66 72.01,12.57 72.01,13.26 | 71.09,11.66 68.81,13.95 68.81,18.06 70.87,20.12 70.87,21.72 C51.1 71.09,21.95 71.09,23.09 72.47,24.46 76.12,24.46 80.47,20.12 80.47,19.66 82.53,17.6 82.53,17.14 C5.1 | 71.09,11.66 C50.2 | 72.01,13.26 v73.61,14.86 | SL5.1 58.75,3.89 59.66,3.89 63.32,7.54 R38.2 63.32,7.77 63.32,10.29 R39.2 63.32,10.52 60.58,13.26 JP5.2 60.58,13.49 58.52,13.49 52.35,19.66 C22.2 52.12,19.89 52.12,23.77 C20.2 52.12,24 52.12,26.29
  Bottom 0.254: IC13.GND 39.55,30.63 37.95,29.03 35.43,29.03 R8.2 35.2,28.8 34.75,28.8 33.6,27.66 31.55,27.66 29.72,29.49 29.72,31.09 IC2.8 29.49,31.32 28.12,32.69 28.12,34.29 | 52.12,26.29 48.46,26.29 48.23,26.52 48.23,30.4 IC4.GND | v69.04,10.52 69.49,10.97 70.87,10.97 C50.2 | 9.83,5.71 9.83,3.89 SL7.9 | 9.83,5.71 9.83,7.77 C11.2 9.6,8 5.26,12.34 5.26,14.17 SL8.9 | 9.83,5.71 15.54,5.71 17.37,3.89 SL7.6 | C10.2 38.41,8 38.41,9.6 33.83,14.17 SL6.9 | 28.12,34.29 29.95,36.12 33.38,36.12 C19.2 33.6,36.35 37.95,40.69 44.35,40.69 X1.+ | 28.12,34.29 C9.1 27.89,34.29 25.15,37.03 | 25.15,37.03 25.38,37.03 26.98,38.63 IC2.10 | 25.15,37.03 16.46,37.03 14.86,38.63 14.4,38.63 IC2.15
  pour Top: 0.95,54.61 116.2,54.61 116.2,0.32 0.95,0.32
  pour Bottom: 0.95,54.61 116.2,54.61 116.2,0.32 0.95,0.32
GON  (via drill 0.61)
  Top 0.254: v66.98,24.23 68.12,23.09 71.09,23.09 73.38,20.8 73.38,20.34 IC15.12 | v64.69,27.43 65.61,28.35 65.61,30.86 v65.15,31.32
  Bottom 0.254: v66.98,24.23 64.69,26.52 v64.69,27.43 | v65.15,31.32 65.15,40.23 61.04,44.35 61.04,45.26 61.49,45.72 64.47,45.72 69.72,40.46 70.87,40.46 R10.1
I1N
  Bottom 0.254: SL11.4 44.58,24 44.58,21.26 R37.1
I1P
  Bottom 0.254: R36.1 41.38,21.26 41.38,24.69 SL11.3
I2N
  Bottom 0.254: R35.1 38.18,21.26 38.18,24.23 38.63,24.69 SL11.2
I2P
  Bottom 0.254: SL11.1 34.75,23.32 34.75,21.26 R34.1
I3N
  Bottom 0.254: R33.1 30.63,21.26 30.63,23.77 29.72,24.69 SL10.5
I3P
  Bottom 0.254: R32.1 27.43,21.26 26.75,21.95 26.75,24.46 26.98,24.69 SL10.4
I4N
  Bottom 0.254: R31.1 24.23,21.26 24.23,24.69 SL10.3
I4P
  Bottom 0.254: R30.1 21.03,21.26 21.03,24 21.72,24.69 SL10.2
I5N
  Bottom 0.254: R29.1 17.83,21.26 17.83,23.32 19.2,24.69 SL10.1
I5P
  Bottom 0.254: R28.1 14.17,21.26 14.17,23.55 13.03,24.69 SL9.5
I6N
  Bottom 0.254: R27.1 11.43,23.77 10.52,24.69 SL9.4
I6P
  Bottom 0.254: R26.1 8.46,21.26 8.46,24.23 8,24.69 SL9.3
I7N
  Bottom 0.254: R25.1 5.94,21.26 5.94,24.23 5.49,24.69 SL9.2
I7P
  Bottom 0.254: R12.1 2.74,21.26 2.74,24.69 SL9.1
LDAC
  Top 0.254: IC14.5 97.84,2.52 100.81,2.52 101.96,1.37 109.27,1.37 110.41,2.52 IC10.5 | 101.04,27.2 100.13,28.12 97.61,28.12 IC7.5 | 101.04,27.2 108.81,27.2 109.73,28.12 IC9.5 | IC15.9 75.89,20.34 79.1,23.55 79.1,24.23 81.84,26.98 IC5.5 | 100.81,14.17 109.04,14.17 109.96,15.09 IC8.5 | 100.81,14.17 99.44,14.17 98.53,15.09 97.61,15.09 IC6.5 | 101.04,27.2 101.04,23.55 100.81,23.32 100.81,14.17
  Bottom 0.254: 92.35,15.77 92.81,15.32 97.38,15.32 IC6.5 | 92.35,15.77 91.9,16.23 89.15,16.23 82.07,23.32 82.07,26.98 IC5.5 | 92.35,15.77 92.35,5.03 94.64,2.74 97.61,2.74 IC14.5
N$1  (via drill 0.61)
  Top 0.254: C26.2 11.43,23.32 11.66,23.55 11.66,25.83 10.97,26.52 7.32,26.52 6.63,25.83 6.63,23.77 5.26,22.4 5.03,22.4 4.12,21.49 v4.12,19.66 | v14.17,12.34 15.77,12.34 17.6,14.17 SL8.4
  Bottom 0.254: 3.2,18.75 2.74,18.29 R12.2 3.2,18.75 | 3.2,18.75 v4.12,19.66 | 14.17,10.74 13.95,10.74 13.72,10.52 9.14,10.52 6.17,13.49 6.17,15.77 3.2,18.75 | 14.17,10.74 15.32,10.74 C27.1 | 14.17,10.74 v14.17,12.34
N$3
  Bottom 0.254: C7.2 21.26,34.52 21.26,31.77 21.72,31.32 IC2.5
N$4  (via drill 0.61)
  Top 0.254: IC15.4 77.5,15.54 78.18,15.54 78.41,15.77 78.41,16.69 78.18,16.92 77.5,16.92 IC15.6 77.27,17.14 v75.89,17.14 | 69.72,18.06 70.87,18.06 v71.55,18.75 | 69.72,18.06 68.81,18.06 IC15.18 | v66.52,19.2 67.67,19.2 67.89,19.43 69.49,19.43 69.72,19.2 69.72,18.06
  Bottom 0.254: JP10.2 65.38,5.26 65.38,13.72 64.92,14.17 JP1.2 64.92,14.4 66.52,16 v66.52,19.2 | v71.55,18.75 71.55,19.43 73.84,21.72 C51.2 73.84,21.95 74.52,22.63 76.35,22.63 76.81,22.17 76.81,17.14 | 76.81,17.14 76.81,16.69 73.84,13.72 73.84,11.2 C50.1 | 76.81,17.14 v75.89,17.14
N$5
  Top 0.254: IC3.3 63.32,38.41 63.32,37.49 62.87,37.03 58.52,37.03 JP3.1
  Bottom 0.254: JP3.1 58.29,37.26 58.29,43.66 R1.2 58.29,43.89 62.18,47.78 63.09,47.78 SL1.3 63.32,48.01 71.09,48.01 SL2.3
N$6  (via drill 0.61)
  Top 0.254: v74.3,8 74.98,8.69 74.98,11.43 IC15.31 | v66.29,6.63 66.29,7.32 61.49,12.12 59.66,12.12 56.01,15.77 56.01,17.37 53.95,19.43 53.95,24.92 49.38,29.49 49.38,31.09 48.01,32.46 48.01,32.92 45.95,34.98 31.09,34.98 | 31.09,34.98 28.12,34.98 24.46,38.63 IC2.11 | 31.09,34.98 31.09,45.03 29.26,46.86 JP7.2
  Bottom 0.254: v74.3,8 72.47,8 71.09,6.63 v66.29,6.63
N$7
  Top 0.254: X1.-1 39.55,50.98 46.41,50.98 48.92,53.49 52.12,53.49 54.41,51.21 L1.1
N$8
  Top 0.254: C32.2 24.23,21.03 24.23,20.57 26.29,18.52 26.29,16.46 26.98,15.77 26.98,8.23 22.63,3.89 SL7.4
  Bottom 0.254: SL7.4 22.4,3.89 19.89,6.4 19.89,7.77 C33.2 19.66,8 18.75,8 16.69,10.06 16.69,15.32 14.4,17.6 14.4,18.06 R28.2
N$9
  Top 0.254: IC2.13 19.43,38.86 19.43,40.92 21.49,42.98 X4.3
N$10
  Bottom 0.254: R999.2 93.73,24.23 96.01,24.23 97.38,22.86 IC6.8
N$11
  Top 0.254: 81.38,18.75 81.61,18.75 C5.2 | 81.38,18.75 77.5,18.75 IC15.8 | 81.38,18.75 81.38,15.77 82.75,14.4 82.75,11.89 Q1.1
N$12
  Top 0.254: D1.A 50.29,36.35 50.29,40.01 54.41,44.12 L1.2
N$13
  Bottom 0.254: C7.1 18.29,34.52 18.29,32.23 19.2,31.32 IC2.4
N$14
  Bottom 0.254: C6.2 14.86,34.75 14.86,33.15 16.69,31.32 IC2.3
N$15  (via drill 0.61)
  Top 0.254: v64.01,18.29 65.84,20.12 70.18,20.12 IC15.16
  Bottom 0.254: v64.01,18.29 62.87,17.14 62.87,13.26 64.47,11.66 64.47,5.71 64.24,5.49 64.24,3.89 65.38,2.74 JP10.1
N$16
  Bottom 0.254: C8.1 8.46,36.35 12.8,36.35 13.49,35.66 13.49,32 14.17,31.32 IC2.2
N$17
  Bottom 0.254: C9.2 25.15,34.29 25.15,32 24.46,31.32 IC2.6
N$18
  Top 0.254: IC15.29 73.38,11.43 73.38,7.09 71.55,5.26 71.55,3.66 70.64,2.74 JP10.5
N$19
  Top 0.254: IC15.7 77.5,17.83 77.95,17.83 81.38,14.4 81.38,8.23 82.75,6.86 Q1.2
  Bottom 0.254: C4.2 84.35,2.06 84.35,5.26 82.98,6.63 Q1.2
N$20
  Top 0.254: IC5.4 74.3,27.2 80.01,27.2 80.92,28.12 89.84,28.12 IC7.4 | IC9.4 102.41,28.35 107.67,28.35 108.58,29.26 111.1,29.26 111.56,28.8 111.56,26.52 104.24,19.2 104.24,16.92 102.64,15.32 IC8.4 | JP10.9 75.67,2.74 76.81,2.74 77.72,3.66 89.15,3.66 90.07,2.74 IC14.4
  Bottom 0.254: 91.9,2.52 94.18,2.52 95.33,1.37 101.73,1.37 102.87,2.52 IC10.4 102.87,2.74 101.04,4.57 101.04,10.52 102.41,11.89 102.41,15.09 IC8.4 | 91.9,2.52 90.3,2.52 IC14.4 | 91.9,2.52 91.9,10.52 90.07,12.34 90.07,15.09 IC6.4 | IC5.4 74.3,26.98 81.38,19.89 81.38,19.43 82.53,18.29 82.98,18.29 83.67,17.6 83.67,15.32 76.81,8.46 76.81,3.89 75.67,2.74 JP10.9
N$21
  Bottom 0.254: R17.2 93.73,11.2 96.7,11.2 97.61,10.29 IC14.8
N$22
  Top 0.254: 69.95,37.03 65.61,37.03 64.92,37.72 64.92,38.41 IC3.2 | 69.27,50.52 63.32,50.52 SL1.2 | 69.27,50.52 71.09,50.52 SL2.2 | 69.95,37.03 69.95,46.86 69.27,47.55 69.27,50.52 | 69.95,37.03 JP4.1
  Bottom 0.254: R2.2 58.29,50.75 62.87,50.75 63.09,50.52 SL1.2
N$23
  Top 0.254: IC15.15 70.87,20.34 70.87,21.03 70.64,21.26 65.61,21.26 62.87,18.52 62.87,11.43 67.89,6.4 67.89,5.26 JP10.4
  Bottom 0.254: JP10.4 69.04,6.17 73.61,6.17 74.52,5.26 75.44,5.26 JP10.10
N$24
  Bottom 0.254: R19.2 113.84,31.77 109.96,35.66 IC9.8
N$26
  Bottom 0.254: R21.2 114.3,21.03 112.01,21.03 110.19,22.86 IC8.8
N$27
  Top 0.254: R40.2 60.81,7.77 60.81,10.29 55.55,15.54 55.55,16 50.29,21.26 49.84,21.26 46.41,24.69 SL11.5
N$28
  Top 0.254: JP10.12 78.18,5.26 90.07,5.26 IC14.3 90.3,5.26 91.21,6.17 100.36,6.17 101.27,5.26 102.87,5.26 IC10.3 | IC5.3 74.3,29.72 80.01,29.72 80.92,30.63 85.95,30.63 87.55,29.03 88.47,29.03 90.07,30.63 IC7.3 90.07,30.86 93.04,30.86 94.18,32 98.53,32 99.67,30.86 102.18,30.86 IC9.3
  Bottom 0.254: 99.21,16.69 101.5,16.69 102.41,17.6 IC8.3 | 99.21,16.69 96.7,16.69 96.01,16 92.81,16 91.21,17.6 90.07,17.6 IC6.3 | 99.21,16.69 99.21,18.29 98.53,18.97 92.58,18.97 92.13,19.43 92.13,28.57 90.07,30.63 IC7.3 | JP10.12 78.18,5.26 78.18,9.14 84.12,15.09 84.12,19.66 81.38,22.4 79.55,22.4 76.12,25.83 76.12,27.66 74.3,29.49 IC5.3
N$29  (via drill 0.61)
  Top 0.254: v19.43,19.66 20.8,21.03 C31.2
  Bottom 0.254: 18.29,18.52 17.83,18.06 R29.2 18.29,18.52 | 18.29,18.52 v19.43,19.66 | SL7.3 24.92,3.89 22.86,5.94 22.86,7.77 C33.1 22.63,8 21.26,9.37 21.26,12.34 21.49,12.57 21.49,15.32 18.29,18.52
N$30  (via drill 0.61)
  Top 0.254: v16.23,19.89 17.37,21.03 18.06,21.03 C30.2
  Bottom 0.254: SL7.2 27.66,3.89 27.66,7.77 C34.2 27.66,8 27.66,14.4 25.15,16.92 | v16.23,19.89 16.23,24 18.75,26.52 24.92,26.52 25.6,25.83 25.6,17.37 25.15,16.92 | 25.15,16.92 22.17,16.92 21.03,18.06 R30.2
N$31
  Bottom 0.254: R13.2 85.72,33.6 82.98,33.6 82.07,34.52 IC5.8
N$32  (via drill 0.61)
  Top 0.254: 21.95,22.4 17.14,22.4 16,21.26 14.63,21.26 C29.2 | 21.95,22.4 22.63,21.72 v22.63,19.66 | v32.23,24.23 32.23,30.63 29.95,32.92 29.26,32.92 28.12,31.77 28.12,30.18 24.46,26.52 24,26.52 23.09,25.6 23.09,23.55 21.95,22.4
  Bottom 0.254: SL7.1 30.18,3.89 30.4,4.12 30.4,7.77 C34.1 30.4,8 30.4,10.29 29.03,11.66 29.03,19.43 29.49,19.89 31.77,19.89 32.23,20.34 v32.23,24.23 | v22.63,19.66 24,18.29 R31.2
N$33
  Top 0.254: IC2.14 16.92,38.86 16.92,41.15 18.75,42.98 X4.2
N$35  (via drill 0.61)
  Top 0.254: JP3.2 58.52,34.75 62.64,34.75 63.32,34.06 63.32,33.38 IC3.6 63.55,33.15 63.55,29.95 v64.69,28.8 | v71.09,13.03 71.78,12.34 71.78,11.66 IC15.27 | v72.92,23.55 69.95,23.55 v69.04,24.46
  Bottom 0.254: v71.09,13.03 70.64,13.03 69.27,14.4 69.27,17.83 72.47,21.03 72.47,23.09 v72.92,23.55 | v69.04,24.46 67.67,25.83 R3.2 67.44,26.06 v64.69,28.8
N$36  (via drill 0.61)
  Top 0.254: v99.67,27.2 v99.67,15.32 | v95.78,42.06 94.18,42.06 90.07,46.18 90.07,48.01 89.38,48.69 82.98,48.69 IC11.13
  Bottom 0.254: R18.1 81.38,44.58 81.38,46.86 IC11.13 | v99.67,15.32 98.53,14.17 93.73,14.17 R17.1 | v99.67,27.2 99.67,30.4 101.5,32.23 103.33,32.23 104.01,32.92 104.01,36.35 102.64,37.72 98.53,37.72 95.78,40.46 v95.78,42.06
N$37
  Top 0.254: IC15.14 71.78,20.34 71.78,20.8 70.87,21.72 65.38,21.72 60.81,17.14 60.81,16 JP5.1
N$38
  Bottom 0.254: IC11.9 91.44,44.58 R16.1 91.21,44.35 92.58,42.98 92.58,38.41 92.35,38.18 92.35,32.92 92.81,32.46 94.41,32.46 95.1,31.77 95.1,30.18 93.73,28.8 93.73,27.2 R999.1
N$39
  Bottom 0.254: R23.2 114.3,10.52 110.87,10.52 110.64,10.29 IC10.8
N$40  (via drill 0.61)
  Top 0.254: v104.93,44.81 103.78,44.81 IC12.13
  Bottom 0.254: R22.1 101.73,44.58 101.73,46.86 IC12.13 | R21.1 114.3,29.72 115.21,30.63 115.21,36.35 112.93,38.63 112.93,40.46 109.27,44.12 109.27,44.35 108.81,44.81 v104.93,44.81
N$42  (via drill 0.61)
  Top 0.254: v34.06,48.23 56.01,48.23 61.95,54.18 64.24,54.18 65.84,52.58 68.58,52.58 68.81,52.81 68.81,53.03 70.18,54.41 107.9,54.41 109.04,53.26 109.04,52.58 110.41,51.21 110.41,38.63 111.56,37.49 111.56,32.92 110.87,32.23 109.04,32.23 106.07,29.26 94.18,29.26 86.18,21.26 86.18,8 83.9,5.71 81.15,5.71 80.01,6.86 80.01,8.91 76.35,12.57 74.52,12.57 74.3,12.34 74.3,11.66 IC15.30
  Bottom 0.254: v34.06,48.23 32.92,48.23 29.26,44.58 JP7.1 29.03,44.35 26.52,44.35 25.83,43.66 25.83,42.75 21.95,38.86 IC2.12
N$43  (via drill 0.61)
  Top 0.254: v61.04,21.49 56.92,21.49 LED1.3
  Bottom 0.254: v61.04,21.49 62.41,21.49 62.64,21.72 R11.2
N$45  (via drill 0.61)
  Top 0.254: 44.81,10.06 44.81,12.8 46.18,14.17 SL6.4 | 34.98,12.34 34.98,11.66 37.26,9.37 37.26,2.74 37.95,2.06 38.86,2.06 39.78,2.97 39.78,5.03 44.81,10.06 | 34.98,12.34 34.98,15.32 35.89,16.23 35.89,19.2 34.75,20.34 34.75,21.03 C38.2 | 44.81,10.06 v44.81,9.6 | v27.66,16.46 27.66,15.54 30.86,12.34 34.98,12.34
  Bottom 0.254: v44.81,9.6 43.43,10.97 C39.2 | v27.66,16.46 27.66,18.06 R32.2
N$46
  Top 0.254: IC15.17 68.58,18.52 67.89,18.52 66.52,17.14 66.52,13.72 66.29,13.49 66.29,8.69 69.04,5.94 69.04,3.66 68.12,2.74 JP10.3
  Bottom 0.254: JP10.11 77.95,2.52 77.04,2.52 75.89,1.37 69.27,1.37 68.12,2.52 JP10.3
N$48
  Top 0.254: C37.2 38.18,21.03 38.18,20.57 40.01,18.75 40.01,17.37 41.15,16.23 46.86,16.23 48.69,14.4 SL6.3
  Bottom 0.254: 46.18,11.66 46.18,11.2 C39.1 46.18,11.66 | 46.18,11.66 48.69,14.17 SL6.3 | 46.18,11.66 45.49,12.34 43.43,12.34 42.75,13.03 42.75,15.09 41.6,16.23 34.29,16.23 32.46,18.06 30.86,18.06 R33.2
N$49  (via drill 0.61)
  Top 0.254: v32.69,19.2 30.86,21.03 C36.2
  Bottom 0.254: R34.2 34.52,18.29 33.6,19.2 v32.69,19.2 32.23,19.2 32,19.43 29.72,19.43 29.49,19.2 29.49,11.89 35.2,6.17 40.92,6.17 42.29,4.8 42.29,2.74 42.98,2.06 44.12,2.06 44.81,2.74 44.81,4.8 45.72,5.71 49.38,5.71 | 49.38,5.71 49.38,5.26 50.06,4.57 50.06,2.52 50.52,2.06 51.66,2.06 52.35,2.74 52.35,6.4 51.89,6.86 51.89,9.83 51.66,10.06 51.66,13.95 51.44,14.17 SL6.2 | 49.38,5.71 49.38,8.69 49.84,9.14 49.84,10.97 C40.2
N$50  (via drill 0.61)
  Top 0.254: IC3.7 64.92,33.38 64.92,34.06 65.61,34.75 69.49,34.75 69.95,34.29 JP4.2 | v80.01,23.32 80.01,22.86 72.69,15.54 72.69,11.66 IC15.28
  Bottom 0.254: v80.01,23.32 79.55,23.32 76.58,26.29 76.58,29.49 75.44,30.63 72.69,30.63 71.09,29.03 69.04,29.03 67.67,30.4 R4.2 67.67,30.63 69.95,32.92 69.95,34.29 JP4.2
N$51
  Bottom 0.254: R5.1 60.12,30.63 56.24,30.63 R6.2 56.01,30.4 55.78,30.18 55.78,25.15 JP2.1
N$54  (via drill 0.61)
  Top 0.254: v67.21,22.63 70.87,22.63 72.47,21.03 72.47,20.34 IC15.13
  Bottom 0.254: v67.21,22.63 66.29,22.63 65.61,21.95 R11.1
N$55  (via drill 0.61)
  Top 0.254: v88.01,29.95 88.01,31.09 89.15,32.23 93.73,32.23 97.38,35.89 IC7.8
  Bottom 0.254: v88.01,29.95 88.01,29.26 87.1,28.35 86.87,28.35 85.72,27.2 R15.2
N$56
  Top 0.254: T1.E 73.15,42.52 73.15,37.49 71.32,35.66 51.44,35.66 50.75,34.98 46.63,34.98 45.49,36.12 40.01,36.12 D1.C
  Bottom 0.254: 38.41,36.35 40.01,36.35 D1.C | 38.41,36.35 36.35,36.35 C19.1 | 38.41,36.35 38.41,32.92 IC13.IN
N$57
  Bottom 0.254: R20.1 101.73,41.83 101.73,39.55 IC12.2 101.73,39.32 103.78,37.26 110.64,37.26 113.39,34.52 113.84,34.52 R19.1
N$58
  Bottom 0.254: IC12.9 111.78,46.86 111.78,43.89 R24.1 112.01,43.89 115.67,40.23 115.67,19.89 114.3,18.52 R23.1
N$59
  Top 0.254: T1.C 72.47,44.81 80.92,44.81 IC11.4 88.01,37.72 104.93,37.72 106.53,39.32 IC12.4
  Bottom 0.254: C1.1 107.9,42.98 107.9,40.69 106.76,39.55 IC12.4 | C21.1 87.55,43.43 87.55,40.69 86.41,39.55 IC11.4
N$60  (via drill 0.61)
  Top 0.254: v73.61,18.29 71.78,16.46 68.81,16.46 IC15.20
  Bottom 0.254: v73.61,18.29 73.61,16.69 C3.2
N$61  (via drill 0.61)
  Top 0.254: v71.09,45.95 71.32,45.72 71.32,42.75 T1.B
  Bottom 0.254: v71.09,45.95 71.09,44.35 R9.2
N$62  (via drill 0.61)
  Top 0.254: v69.04,38.63 66.06,38.63 IC3.1
  Bottom 0.254: 55.32,49.15 55.32,50.75 R2.1 | 55.32,49.15 55.32,43.89 R1.1 55.55,43.66 55.55,37.72 57.38,35.89 59.44,35.89 61.49,33.83 61.49,29.49 58.29,26.29 58.29,25.15 JP2.2 | v69.04,38.63 74.3,38.63 74.98,39.32 74.98,46.41 72.24,49.15 55.32,49.15
N$63  (via drill 0.61)
  Top 0.254: v68.35,44.58 66.75,44.58 T2.C
  Bottom 0.254: v68.35,44.58 70.18,42.75 72.24,42.75 73.61,44.12 R9.1
N$64  (via drill 0.61)
  Top 0.254: v69.04,42.52 69.04,42.75 68.35,43.43 66.75,43.43 65.84,42.52 T2.B
  Bottom 0.254: v69.04,42.52 69.72,42.52 70.64,41.6 72.47,41.6 73.61,40.46 R10.2
N$70  (via drill 0.61)
  Top 0.254: SL8.2 22.86,14.4 21.03,16.23 14.86,16.23 14.4,15.77 13.49,15.77 12.57,16.69 8.23,16.69 7.54,17.37 7.54,18.97 6.17,20.34 6.17,21.03 C24.2 5.94,21.26 v7.32,22.63
  Bottom 0.254: C28.1 22.63,11.2 22.63,13.95 22.86,14.17 SL8.2 | v7.32,22.63 7.32,20.12 8.46,18.97 8.46,18.29 R26.2
N$71  (via drill 0.61)
  Top 0.254: v9.37,22.63 8.91,22.17 8.91,21.26 C25.2 | v13.26,11.43 17.37,11.43 20.12,14.17 SL8.3
  Bottom 0.254: v9.37,22.63 9.83,22.17 9.83,17.14 | 9.83,17.14 9.6,16.92 7.32,16.92 6.17,18.06 R25.2 | C27.2 18.29,10.97 18.29,12.34 20.12,14.17 SL8.3 | 9.83,17.14 11.66,15.32 11.66,13.03 v13.26,11.43
N$72  (via drill 0.61)
  Top 0.254: v52.81,9.37 52.81,12.57 53.95,13.72 53.95,14.17 SL6.1 | v27.66,22.63 27.66,21.26 C35.2 | v52.12,18.06 51.44,18.06 46.63,22.86 40.69,22.86 v40.46,22.63
  Bottom 0.254: v52.81,9.37 52.81,10.97 C40.1 | v27.66,22.63 27.66,23.09 28.35,23.77 28.35,25.83 29.03,26.52 31.32,26.52 33.38,24.46 33.38,20.12 34.06,19.43 36.8,19.43 37.95,18.29 R35.2 38.18,18.29 39.55,19.66 39.55,21.72 v40.46,22.63 | v52.12,18.06 53.95,16.23 53.95,14.4 SL6.1
N$73
  Bottom 0.254: R15.1 85.72,31.32 88.01,33.6 88.01,36.12 91.44,39.55 | 91.44,39.55 91.44,41.83 R666.1 | 91.44,39.55 IC11.6
N$74  (via drill 0.61)
  Top 0.254: v4.12,23.09 2.74,21.72 2.74,21.26 C23.2 | v13.95,16.69 23.09,16.69 25.38,14.4 SL8.1
  Bottom 0.254: C28.2 25.38,11.2 25.38,14.17 SL8.1 | v4.12,23.09 4.12,25.83 4.8,26.52 10.97,26.52 11.89,25.6 11.89,22.86 12.8,21.95 12.8,19.66 11.43,18.29 R27.2 11.43,18.06 12.8,16.69 v13.95,16.69
N$76
  Top 0.254: C42.2 44.81,21.03 47.09,21.03 52.58,15.54 52.58,13.03 51.21,11.66 51.21,3.89 SL5.4
  Bottom 0.254: SL5.4 50.98,3.89 50.75,4.12 50.75,7.54 C43.2 50.75,7.77 51.21,8.23 51.21,12.12 50.29,13.03 50.29,15.09 49.15,16.23 44.58,16.23 42.75,18.06 41.38,18.06 R36.2
N$78  (via drill 0.61)
  Top 0.254: v42.98,19.43 41.83,20.57 | 41.83,20.57 41.38,21.03 C41.2 41.83,20.57 | 41.83,20.57 43.66,22.4 46.41,22.4 51.66,17.14 53.49,17.14 55.09,15.54 55.09,13.03 53.72,11.66 53.72,3.89 SL5.3
  Bottom 0.254: C43.1 53.49,7.54 53.49,3.89 SL5.3 | v42.98,19.43 43.43,19.43 44.58,18.29 R37.2
N$91
  Bottom 0.254: R13.1 84.35,36.35 81.38,39.32 IC11.2 81.38,39.55 81.38,41.83 R14.1 | R13.1
N$96
  Top 0.254: IC12.6 111.78,39.55 114.3,39.55 IC12.7
SCL2  (via drill 0.61)
  Top 0.254: SL8.8 7.77,14.17 12.34,9.6 12.34,3.89 SL7.8 12.57,3.66 14.63,1.6 39.09,1.6 41.15,3.66 SL5.8 41.15,3.89 44.58,7.32 | v60.81,22.86 63.32,25.38 72.47,25.38 74.07,23.77 74.07,20.34 IC15.11 | v50.29,22.17 v53.03,22.17 | v48.23,17.14 50.06,15.32 50.06,12.8 44.58,7.32 | 44.58,7.32 v44.35,7.32
  Bottom 0.254: 39.32,12.34 38.18,12.34 36.35,14.17 SL6.8 | 39.32,12.34 41.15,14.17 SL6.6 | v60.81,22.86 53.72,22.86 v53.03,22.17 | v50.29,22.17 49.61,22.17 48.23,20.8 v48.23,17.14 | v44.35,7.32 39.32,12.34
SDA2  (via drill 0.61)
  Top 0.254: SL7.7 14.86,3.89 14.86,8.46 10.29,13.03 10.29,14.17 SL8.7 | SL5.7 43.66,3.89 45.95,3.89 SL5.6 | v67.89,32.23 67.89,31.32 74.98,24.23 74.98,20.34 IC15.10 | v61.95,44.81 58.06,44.81 55.55,47.32 33.6,47.32 30.18,50.75 28.12,50.75 24.23,46.86 24.23,44.81 23.09,43.66 23.09,37.95 27.66,33.38 30.18,33.38 34.98,28.57 34.98,23.09 36.35,21.72 36.35,16.69 38.63,14.4 SL6.7 38.86,14.17 v38.86,11.43
  Bottom 0.254: v67.89,32.23 67.89,38.86 v61.95,44.81 | v38.86,11.43 43.43,6.86 43.43,3.89 SL5.7 | SL7.7 15.09,3.66 16.69,2.06 31.77,2.06 35.43,5.71 38.86,5.71 39.78,4.8 39.78,2.74 40.92,1.6 44.35,1.6 45.95,3.2 45.95,3.66 SL5.6
SFET1
  Bottom 0.254: R24.2 114.76,43.89 114.76,46.41 114.3,46.86 IC12.8 114.3,47.09 112.7,48.69 106.53,48.69 103.33,51.89 102.87,51.89 SL4.3
SFET2
  Bottom 0.254: IC12.1 98.98,39.55 98.98,41.83 R20.2 98.98,42.06 100.13,43.2 100.13,51.89 SL4.2
SFET3
  Top 0.254: SL4.1 97.84,51.89 97.84,48.23 98.98,47.09 IC12.14
  Bottom 0.254: R22.2 98.98,44.58 98.98,46.86 IC12.14
SFET4
  Bottom 0.254: IC11.7 94.18,39.55 94.18,41.83 R666.2 94.18,42.06 92.81,43.43 92.81,47.78 91.9,48.69 90.07,48.69 86.87,51.89 86.41,51.89 SL3.4
SFET5
  Top 0.254: SL3.3 83.9,51.89 84.35,51.89 87.1,49.15 91.9,49.15 93.95,47.09 IC11.8
  Bottom 0.254: R16.2 94.18,44.58 94.18,46.86 IC11.8
SFET6
  Bottom 0.254: IC11.1 78.64,39.55 78.64,41.83 R14.2 78.64,42.06 79.78,43.2 79.78,47.78 81.15,49.15 81.15,51.89 SL3.2
SFET7
  Top 0.254: SL3.1 78.87,51.89 78.87,47.09 IC11.14
  Bottom 0.254: R18.2 78.64,44.58 78.64,46.86 IC11.14
U
  Top 0.254: R40.1 63.55,7.54 63.09,7.54 61.27,5.71 58.06,5.71 56.24,3.89 SL5.2
  Bottom 0.254: C22.1 49.61,19.66 49.61,18.52 52.81,15.32 52.81,13.26 53.72,12.34 58.52,12.34 60.35,10.52 R39.1 60.58,10.29 60.58,7.77 R38.1 60.35,7.54 59.89,7.54 56.24,3.89 SL5.2
VDD  (via drill 0.61)
  Top 0.254: JP7.4 29.03,51.89 21.95,51.89 11.89,41.83 11.89,38.86 IC2.16 | SL8.6 12.57,14.4 10.74,16.23 4.57,16.23 2.74,14.4 SL8.10 | v35.66,9.6 35.66,3.89 SL5.10 | 66.06,33.15 72.92,33.15 74.3,34.52 IC5.1 | LED1.1 55.78,19.43 55.78,22.17 56.92,23.32 58.98,23.32 60.58,24.92 JP2.3 | 62.18,32.46 62.18,29.26 60.81,27.89 60.81,26.06 | 62.18,32.46 62.18,33.15 IC3.5 62.18,32.46 | 60.81,26.06 60.81,25.15 JP2.3 | 62.18,32.46 49.61,32.46 IC4.OUT | 66.06,33.15 66.06,27.43 64.69,26.06 60.81,26.06 | 66.06,33.15 IC3.8 | 60.81,26.06 JP2.3 | 95.33,15.32 97.61,17.6 IC6.6 | 95.33,15.32 IC14.1 | IC7.1 90.07,35.89 95.33,35.89 96.47,37.03 101.04,37.03 102.18,35.89 IC9.1 | IC14.6 97.84,5.03 100.81,5.03 101.96,3.89 109.27,3.89 110.41,5.03 IC10.6 | 95.33,15.32 100.36,10.29 102.87,10.29 IC10.1
  Bottom 0.254: IC2.16 11.66,38.63 8.46,38.63 6.17,36.35 5.71,36.35 C8.2 5.71,36.12 5.71,31.77 5.94,31.55 5.94,29.26 | C10.1 35.66,8 v35.66,9.6 35.66,9.83 31.32,14.17 SL6.10 | SL5.10 35.66,3.66 34.06,3.66 32,1.6 9.37,1.6 7.32,3.66 SL7.10 7.09,3.89 6.86,4.12 6.86,7.77 C11.1 6.63,8 2.74,11.89 2.74,14.17 SL8.10 2.52,14.4 1.14,15.77 1.14,25.38 2.29,26.52 3.2,26.52 5.94,29.26 | 74.3,34.52 70.41,30.63 R4.1 | 74.3,34.52 76.12,32.69 76.12,32.23 77.95,30.4 77.95,29.72 C15.1 78.18,29.72 81.84,29.72 IC5.6 82.07,29.49 82.07,29.03 83.67,27.43 83.67,26.52 83.21,26.06 83.21,25.15 85.5,22.86 IC6.1 90.07,22.86 90.07,22.17 91.67,20.57 91.67,19.2 93.5,17.37 C14.1 93.73,17.37 97.16,17.37 97.38,17.6 IC6.6 | 74.3,34.52 IC5.1 | C2.1 49.38,27.66 49.38,32.23 IC4.OUT 49.38,32.46 48.46,33.38 46.41,33.38 45.95,32.92 45.95,27.89 45.26,27.2 31.32,27.2 29.26,29.26 5.94,29.26 | 62.87,29.72 62.87,27.2 61.27,25.6 | 62.87,29.72 62.87,30.4 R5.2 62.87,29.72 | 61.27,25.6 60.81,25.15 JP2.3 61.27,25.6 | 62.87,29.72 66.06,29.72 69.72,26.06 70.18,26.06 R3.1 | 61.27,25.6 64.01,22.86 64.01,21.26 64.92,20.34 64.92,16.92 JP1.1 | IC7.1 91.67,34.06 91.67,32.92 93.5,31.09 C13.1 | IC9.1 102.41,35.66 97.61,30.86 IC7.6 97.38,30.63 95.78,29.03 95.78,27.66 97.16,26.29 102.64,26.29 | IC9.6 109.73,30.63 109.5,30.4 106.53,30.4 C17.1 106.3,30.18 102.64,26.52 102.64,26.29 | 102.64,26.29 102.64,22.86 | 107.67,17.37 109.73,17.37 109.96,17.6 IC8.6 | 107.67,17.37 106.53,17.37 C18.1 106.3,17.14 106.3,13.72 102.87,10.29 IC10.1 102.87,10.06 105.61,7.32 105.61,6.86 106.98,5.49 C12.1 107.21,5.26 110.41,5.26 IC10.6
  Bottom 0.254: IC14.6 97.38,5.49 94.18,5.49 C16.1 | 102.64,22.86 105.84,22.86 107.67,21.03 107.67,17.37 | 102.64,22.86 IC8.1
VREF
  Top 0.254: 87.1,45.26 85.95,45.26 84.35,46.86 83.9,46.86 IC11.12 | 87.1,45.26 88.7,46.86 IC11.10 | 88.7,41.15 88.7,43.66 87.1,45.26 | 88.7,41.15 88.7,39.55 IC11.5 | 88.7,41.15 102.41,41.15 104.01,39.55 IC12.3
  Bottom 0.254: 41.38,33.83 40.46,33.83 39.78,33.15 39.78,32.46 38.86,31.55 35.66,31.55 33.15,29.03 32.69,29.03 R8.1 | 41.38,33.83 44.58,30.63 44.58,29.03 R7.2 | IC11.3 83.9,39.32 85.5,37.72 87.1,37.72 88.7,39.32 IC11.5 | 104.01,45.72 104.01,46.86 IC12.12 104.01,45.72 | 104.01,45.72 104.01,39.55 IC12.3 | 104.01,45.72 105.39,45.72 105.84,45.26 107.44,45.26 109.04,46.86 IC12.10 | 41.38,33.83 41.38,34.52 52.81,45.95 52.81,51.21 55.78,54.18 81.38,54.18 82.75,52.81 82.75,48.01 83.67,47.09 IC11.12

### Text on the board
Top: 1 | 1 | 3 | 5 | 1
Bottom: electronic load | V04.1 | DK1RI